# EAGLE design CARTE E-STOP (EAGLE 9.5.2)
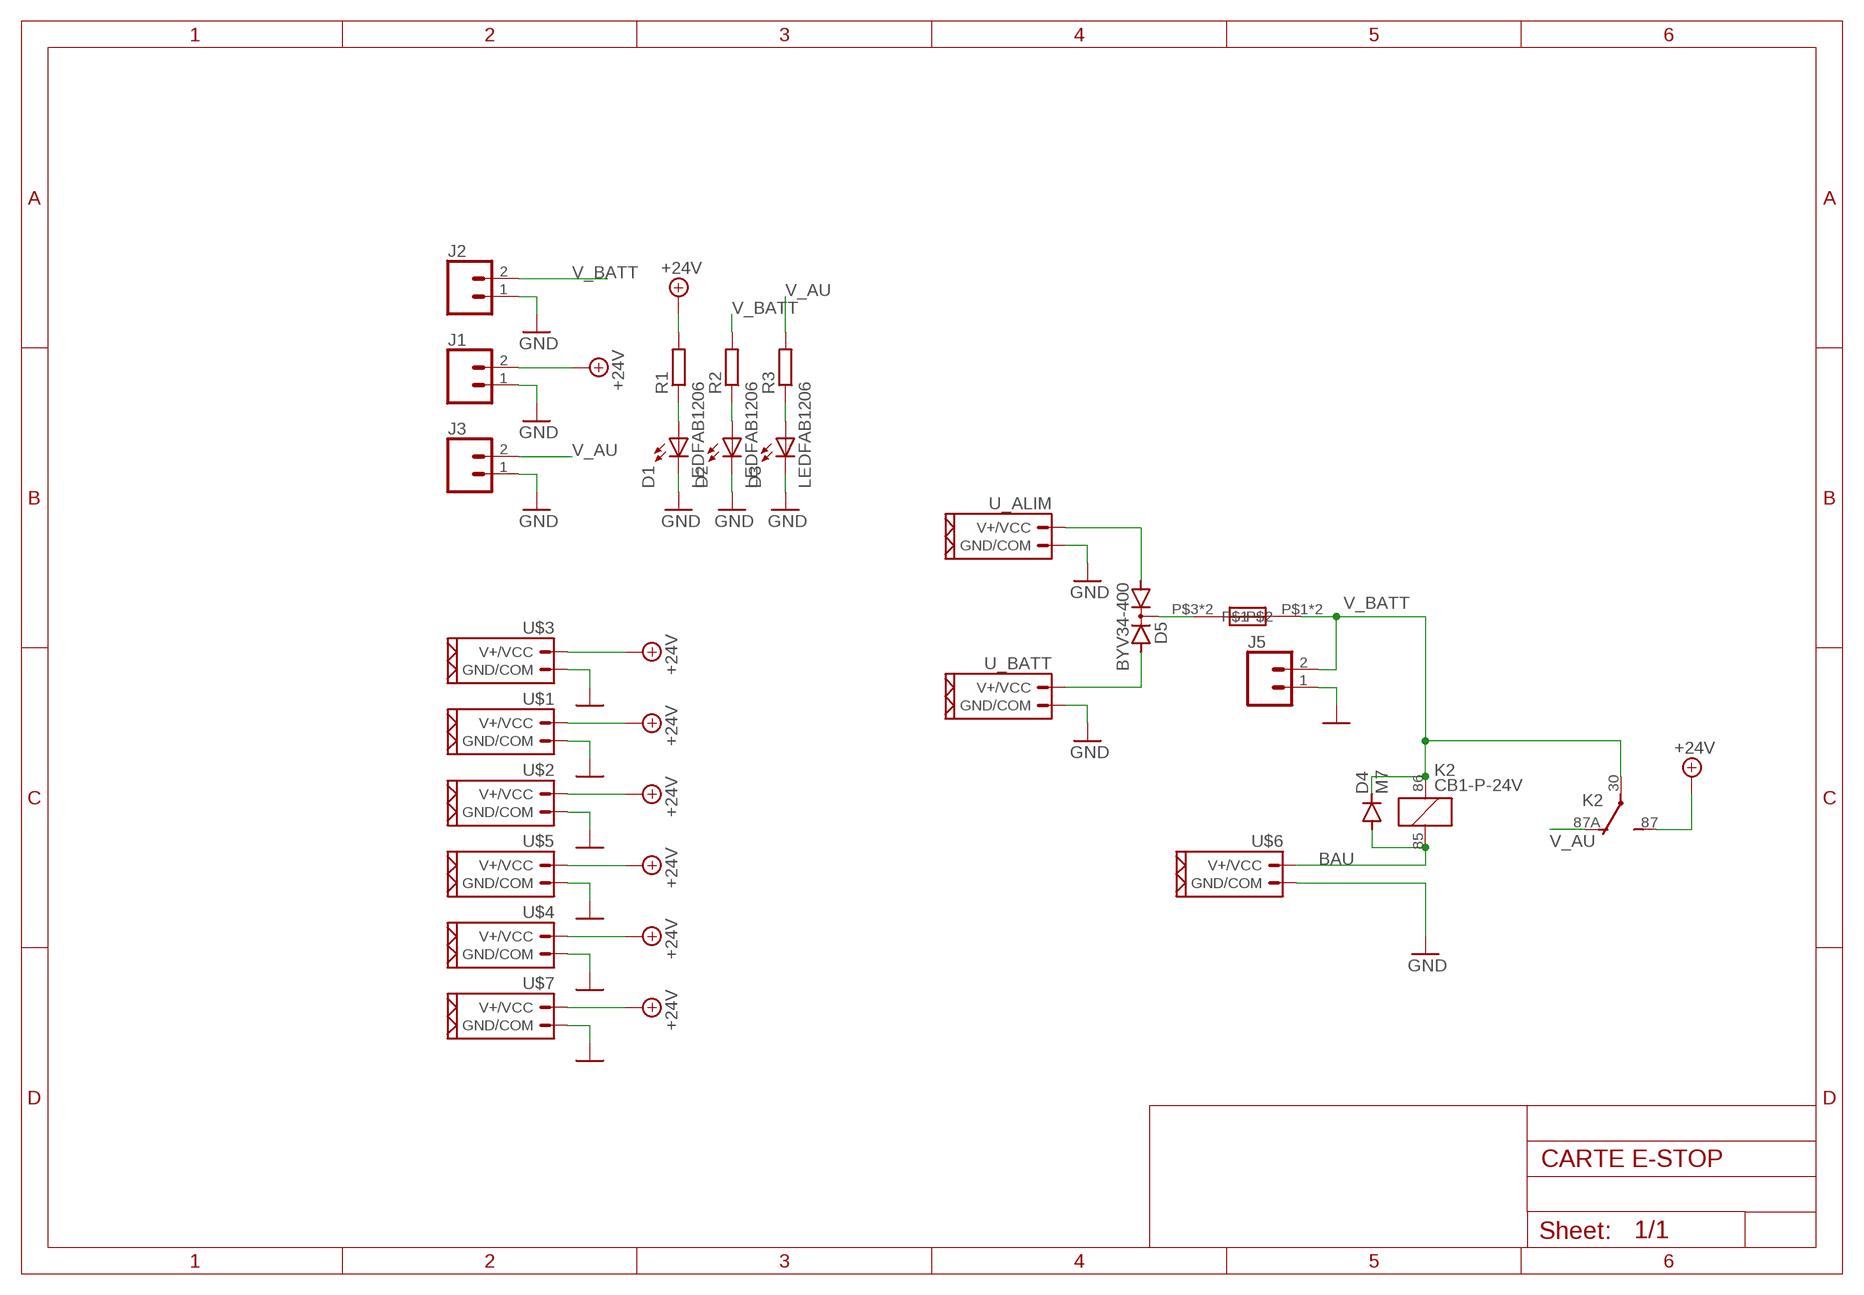
[diagram p0: schematic, sheet 1]

## Parts
D1  LEDFAB1206  [LED1206FAB]
D2  LEDFAB1206  [LED1206FAB]
D3  LEDFAB1206  [LED1206FAB]
D4  M7  GF1  [SMA-DO214AC]
D5  BYV34-400  BYV32  [TO220ABS]
J1  CONN_02POLAR  [MOLEX-1X2]
J2  CONN_02POLAR  [MOLEX-1X2]
J3  CONN_02POLAR  [MOLEX-1X2]
J5  CONN_02POLAR  [MOLEX-1X2]
K2  CB1-P-24V  [CB1]
R1  R-EU_M1206  [M1206]
R2  R-EU_M1206  [M1206]
R3  R-EU_M1206  [M1206]
U$1  CONN_02_PUIXT30  [XT30_FEMALE]
U$2  CONN_02_PUIXT30  [XT30_FEMALE]
U$3  CONN_02_PUIXT30  [XT30_FEMALE]
U$4  CONN_02_PUIXT30  [XT30_FEMALE]
U$5  CONN_02_PUIXT30  [XT30_FEMALE]
U$6  CONN_02_PUI  [NSK396-2C]
U$7  CONN_02_PUIXT30  [XT30_FEMALE]
U$8  AUTOMOTIVE_FUSE3557-2  [3557-2]
U_ALIM  CONN_02_PUIXT60  [XT60]
U_BATT  CONN_02_PUIXT60  [XT60]

## Nets
+24V: J1.2 K2.87(2:S) R1.2 U$1.P$1(V+/VCC) U$2.P$1(V+/VCC) U$3.P$1(V+/VCC) U$4.P$1(V+/VCC) U$5.P$1(V+/VCC) U$7.P$1(V+/VCC)
BAU: D4.A K2.85 U$6.P$2(V+/VCC)
GND: D1.2(C) D2.2(C) D3.2(C) J1.1 J2.1 J3.1 J5.1 U$1.P$2(GND/COM) U$2.P$2(GND/COM) U$3.P$2(GND/COM) U$4.P$2(GND/COM) U$5.P$2(GND/COM) U$6.P$1(GND/COM) U$7.P$2(GND/COM) U_ALIM.P$2(GND/COM) U_BATT.P$2(GND/COM)
N$1: D1.1(A) R1.1
N$2: D2.1(A) R2.1
N$3: D3.1(A) R3.1
N$5: D5.A1 U_ALIM.P$1(V+/VCC)
N$6: D5.C U$8.P$3 U$8.P$4
N$7: D5.A2 U_BATT.P$1(V+/VCC)
V_AU: J3.2 K2.87A(2:O) R3.2
V_BATT: D4.K(C) J2.2 J5.2 K2.30(2:P) K2.86 R2.2 U$8.P$1 U$8.P$2

## Library data of the parts
D1-D3 = fab:LED: LED
D4 = diode:GF1: DIODE
D5 = diode:BYV32: DIODE 2 x Si diode 200 V, 20 A/230 Apeak, 25 ns
J1-J3 J5 = OPENBOT:CONN_02: Multi connection point. Often used as Generic Header-pin footprint for 0.1 inch spaced/style header connections On any of the 0.1 inch spaced packages, you can populate with these: Break Away Headers - Straight <https://www.sparkfun.com/products/116> (PRT-00116) Break Away Male Headers - Right Angle <https://www.sparkfun.com/products/553> (PRT-00553) Female Headers <https://www.sparkfun.com/products/115> (PRT-00115) Break Away Headers - Machine Pin <https://www.sparkfun.com/products/117> (PRT-00117) Break Away Female Headers - Swiss Machine Pin <https://www.sparkfun.com/products/743> (PRT-00743) For SCREWTERMINALS and SPRING TERMINALS visit here: Screw Terimnals on SparkFun.com <https://www.sparkfun.com/search/results?term=Screw+Terminals> (5mm/3.5mm/2.54mm spacing) This device is also useful as a general connection point to wire up your design to another part of your project. Our various solder wires solder well into these plated through hole pads. Hook-Up Wire - Assortment (Stranded, 22 AWG) <https://www.sparkfun.com/products/11375> (PRT-11375) Hook-Up Wire - Assortment (Solid Core, 22 AWG) <https://www.sparkfun.com/products/11367> (PRT-11367) View the entire wire category on our website here <https://www.sparkfun.com/categories/141> Special notes: Molex polarized connector foot print use with: PRT-08233 with associated crimp pins and housings. 2.54_SCREWTERM for use with PRT-10571. 3.5mm Screw Terminal footprints for PRT-08084 5mm Screw Terminal footprints for use with PRT-08432 Multi connection point. Often used as Generic Header-pin footprint for 0.1 inch spaced/style header connections On any of the 0.1 inch spaced packages, you can populate with these: Break Away Headers - Straight <https://www.sparkfun.com/products/116> (PRT-00116) Break Away Male Headers - Right Angle <https://www.sparkfun.com/products/553> (PRT-00553) Female Headers <https://www.sparkfun.com/products/115> (PRT-00115) Break Away Headers - Machine Pin <https://www.sparkfun.com/products/117> (PRT-00117) Break Away Female Headers - Swiss Machine Pin <https://www.sparkfun.com/products/743> (PRT-00743) For SCREWTERMINALS and SPRING TERMINALS visit here: Screw Terimnals on SparkFun.com <https://www.sparkfun.com/search/results?term=Screw+Terminals> (5mm/3.5mm/2.54mm spacing) This device is also useful as a general connection point to wire up your design to another part of your project. Our various solder wires solder well into these plated through hole pads. Hook-Up Wire - Assortment (Stranded, 22 AWG) <https://www.sparkfun.com/products/11375> (PRT-11375) Hook-Up Wire - Assortment (Solid Core, 22 AWG) <https://www.sparkfun.com/products/11367> (PRT-11367) View the entire wire category on our website here <https://www.sparkfun.com/categories/141> Special notes: Molex polarized connector foot print use with: PRT-08233 with associated crimp pins and housings. 2.54_SCREWTERM for use with PRT-10571. 3.5mm Screw Terminal footprints for PRT-08084 5mm Screw Terminal footprints for use with PRT-08432; SF_ID: PRT-09918
K2 = relay:CB1*: HIGH POWER AUTOMOTIVE RELAY Form C NAiS Source: http://www.mew-europe.com/.. en_ds_61202_0000.pdf; MF: AROMAT/ MATSUSHITA; MPN: CB1-P-24V; OC_FARNELL: 4168987; OC_NEWARK: 07C0827
R1-R3 = rcl:R-EU_: RESISTOR, European symbol; SPICEPREFIX: R
U$1-U$7 U_ALIM U_BATT = OPENBOT:CONN_02_PUI
U$8 = OPENBOT:AUTOMOTIVE_FUSE

## Board
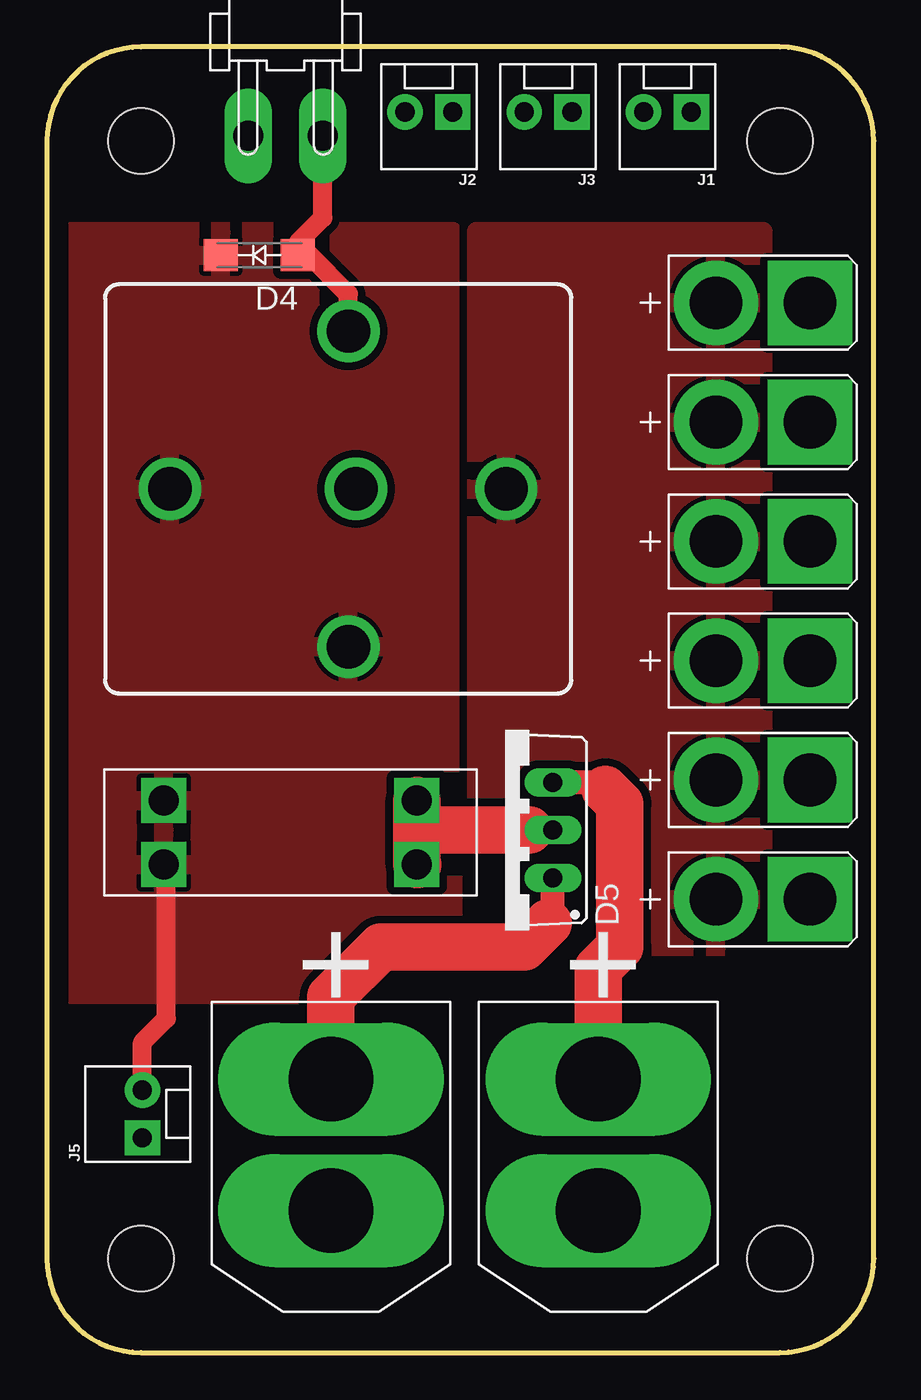
[diagram p1: board, top side]
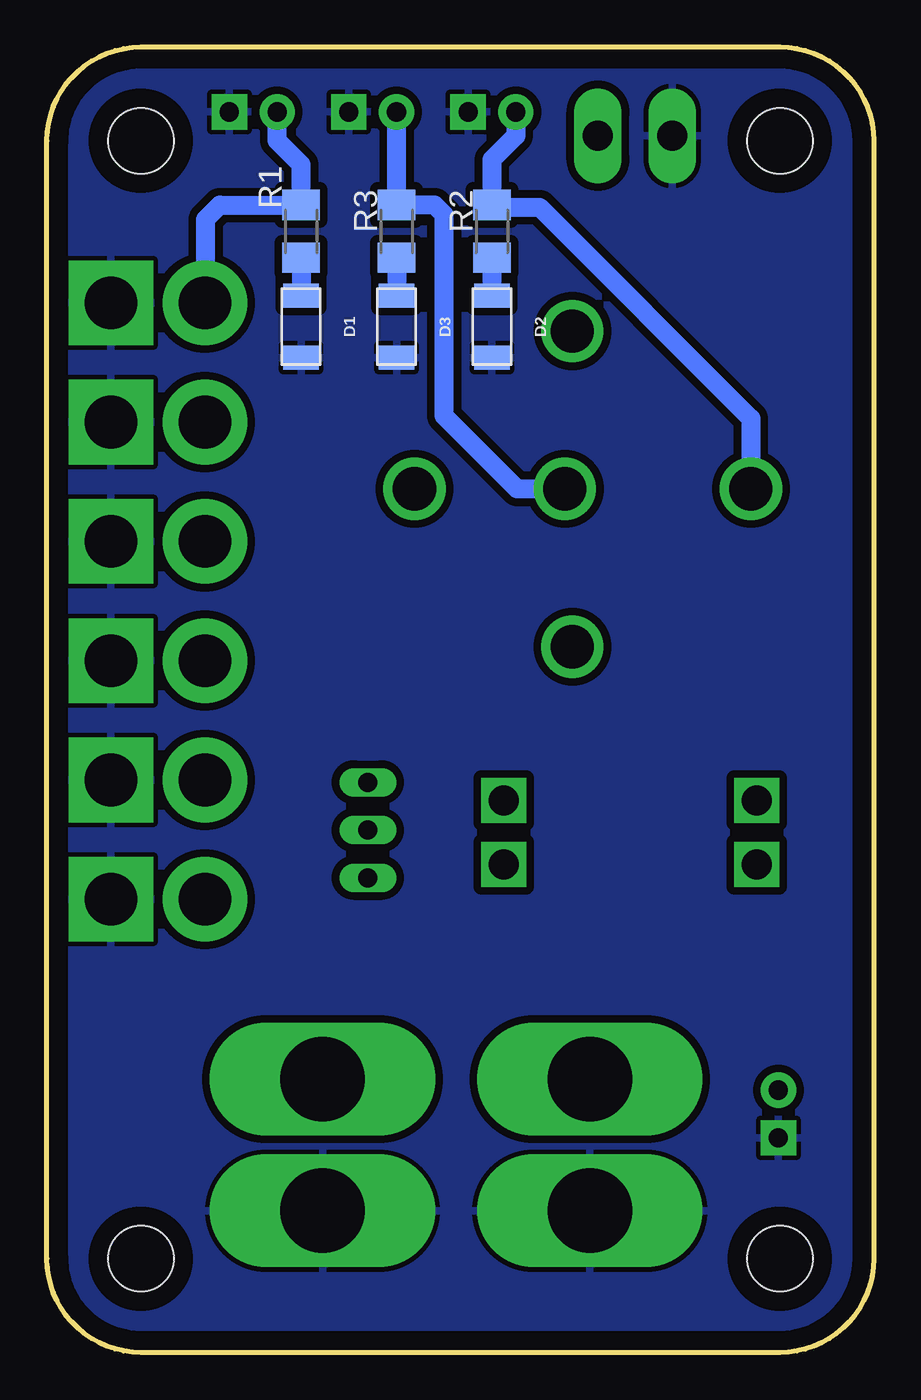
[diagram p2: board, bottom side, seen from below]

Size 44 x 69.5 mm. Coordinates in mm from the lower left corner, seen from the top.
Outline: 0,5 arc90 5,0 39,0 arc90 44,5 44,64.5 arc90 39,69.5 5,69.5 arc90 0,64.5 0,5
Copper layers (1*16): Top 0.035mm / dielectric 1.5mm / Bottom 0.035mm
Design rules "default *": minimum track width 6mil, minimum drill 0.35mm, track to track 16mil, track to pad 16mil, pad to pad 6mil, via to via 6mil, smd to smd 6mil, copper to edge 40mil, drill to drill 6mil, minimum pad ring 10mil, minimum via ring 8mil, stop-mask expansion 4mil, vias tented up to drill 0mil, thermal gap 10mil
Holes 3.5 mm at 5,64.5 39,64.5 39,5 5,5

### Footprints (pad centres in the part's own frame; a part is rotated, then mirrored left to right if it is on the bottom)
LED1206FAB = smd 1.27 x 1.905: 1 -1.651,0; 2 1.651,0
SMA-DO214AC = smd 1.8 x 1.7: A -2.05,0; K 2.05,0
TO220ABS = drill 1.016 long: A1 -2.54,-2.54; A2 2.54,-2.54; C 0,-2.54
MOLEX-1X2 = drill 1.016 pad 1.88 square: 1 0,0 | drill 1.016 pad 1.88: 2 2.54,0
CB1 = drill 2.3: 30 8.95,0; 85 -0.55,-8.4; 86 -0.55,8.4; 87 -8.95,0; 87A -0.95,0
M1206 = smd 1.6 x 2: 1 -1.4,0; 2 1.4,0
XT30_FEMALE = drill 2.8 pad 4.5: P$1 -2.5,0 | drill 2.8 pad 4.5 square: P$2 2.5,0
NSK396-2C = drill 1.6 pad 2.54 long: P$1 -1.98,0; P$2 1.98,0
3557-2 = drill 1.6 square: P$1 -6.731,1.702; P$2 -6.731,-1.702; P$3 6.731,1.702; P$4 6.731,-1.702
XT60 = drill 4.5 pad 6 long: P$1 -3.5,0; P$2 3.5,0

### Placement (x,y rotation side)
D1  30.48,54.61 270 bottom
D2  20.32,54.61 270 bottom
D3  25.4,54.61 270 bottom
D4  11.3,58.42 180 top
D5  24.38,27.81 90 top
J1  34.29,66.04 180 top
J2  21.59,66.04 180 top
J3  27.94,66.04 180 top
J5  5.08,11.43 90 top
K2  15.49,45.97 180 top
R1  30.48,59.69 90 bottom
R2  20.32,59.69 90 bottom
R3  25.4,59.69 90 bottom
U$1  38.1,43.18 0 top
U$2  38.1,49.53 0 top
U$3  38.1,36.83 0 top
U$4  38.1,55.88 0 top
U$5  38.1,30.48 0 top
U$6  12.7,64.77 0 top
U$7  38.1,24.13 0 top
U$8  12.95,27.69 0 top
U_ALIM  15.11,11.05 270 top
U_BATT  29.34,11.05 270 top

### Tracks (layer width: path | path; a pad name or v marks a point on that pad's centre or on a via)
+24V
  Bottom 1.016: U$4.P$1 35.56,55.92 35.56,60.33 34.8,61.09 R1.2 30.48,63.25 31.75,64.52 J1.2
  pour Top (rank 4): 22.86,21.59 22.86,59.69 38.1,59.69 38.1,21.59
BAU
  Top 1.016: K2.85 16.04,56.35 13.97,58.42 D4.A 13.35,59.07 14.68,60.4 U$6.P$2
GND
  pour Bottom (rank 6): -1.27,71.12 45.72,71.12 45.72,-1.27 -1.27,-1.27
N$1
  Bottom 1.016: R1.1 D1.1
N$2
  Bottom 1.016: R2.1 D2.1
N$3
  Bottom 1.016: R3.1 D3.1
N$5
  Top 1.27: 26.67,22.86 26.92,23.11 D5.A1
  Top 2.54: U_ALIM.P$1 15.11,18.92 17.78,21.59 25.4,21.59 26.67,22.86
N$6
  Top 1.27: D5.C 25.65,27.81
  Top 2.54: 19.74,25.98 U$8.P$4 19.68,27.81 | 19.68,27.81 U$8.P$3 | 25.65,27.81 19.68,27.81
N$7
  Top 1.27: 29.72,29.97 29.34,30.35 D5.A2
  Top 2.54: U_BATT.P$1 29.34,20.45 30.48,21.59 30.48,29.21 29.72,29.97
V_AU
  Bottom 1.016: J3.2 R3.2 23.37,61.09 22.86,60.58 22.86,49.85 18.98,45.97 K2.87A
V_BATT
  Top 1.016: J5.2 5.08,16.51 6.35,17.78 6.35,25.86 U$8.P$2
  Bottom 1.016: K2.30 6.54,49.72 17.78,60.96 20.19,60.96 R2.2 20.32,63.5 19.05,64.77 J2.2
  pour Top (rank 5): 1.27,19.05 1.27,59.69 21.59,59.69 21.59,19.05